# Altium schematic sheet ULA.SchDoc
size A3
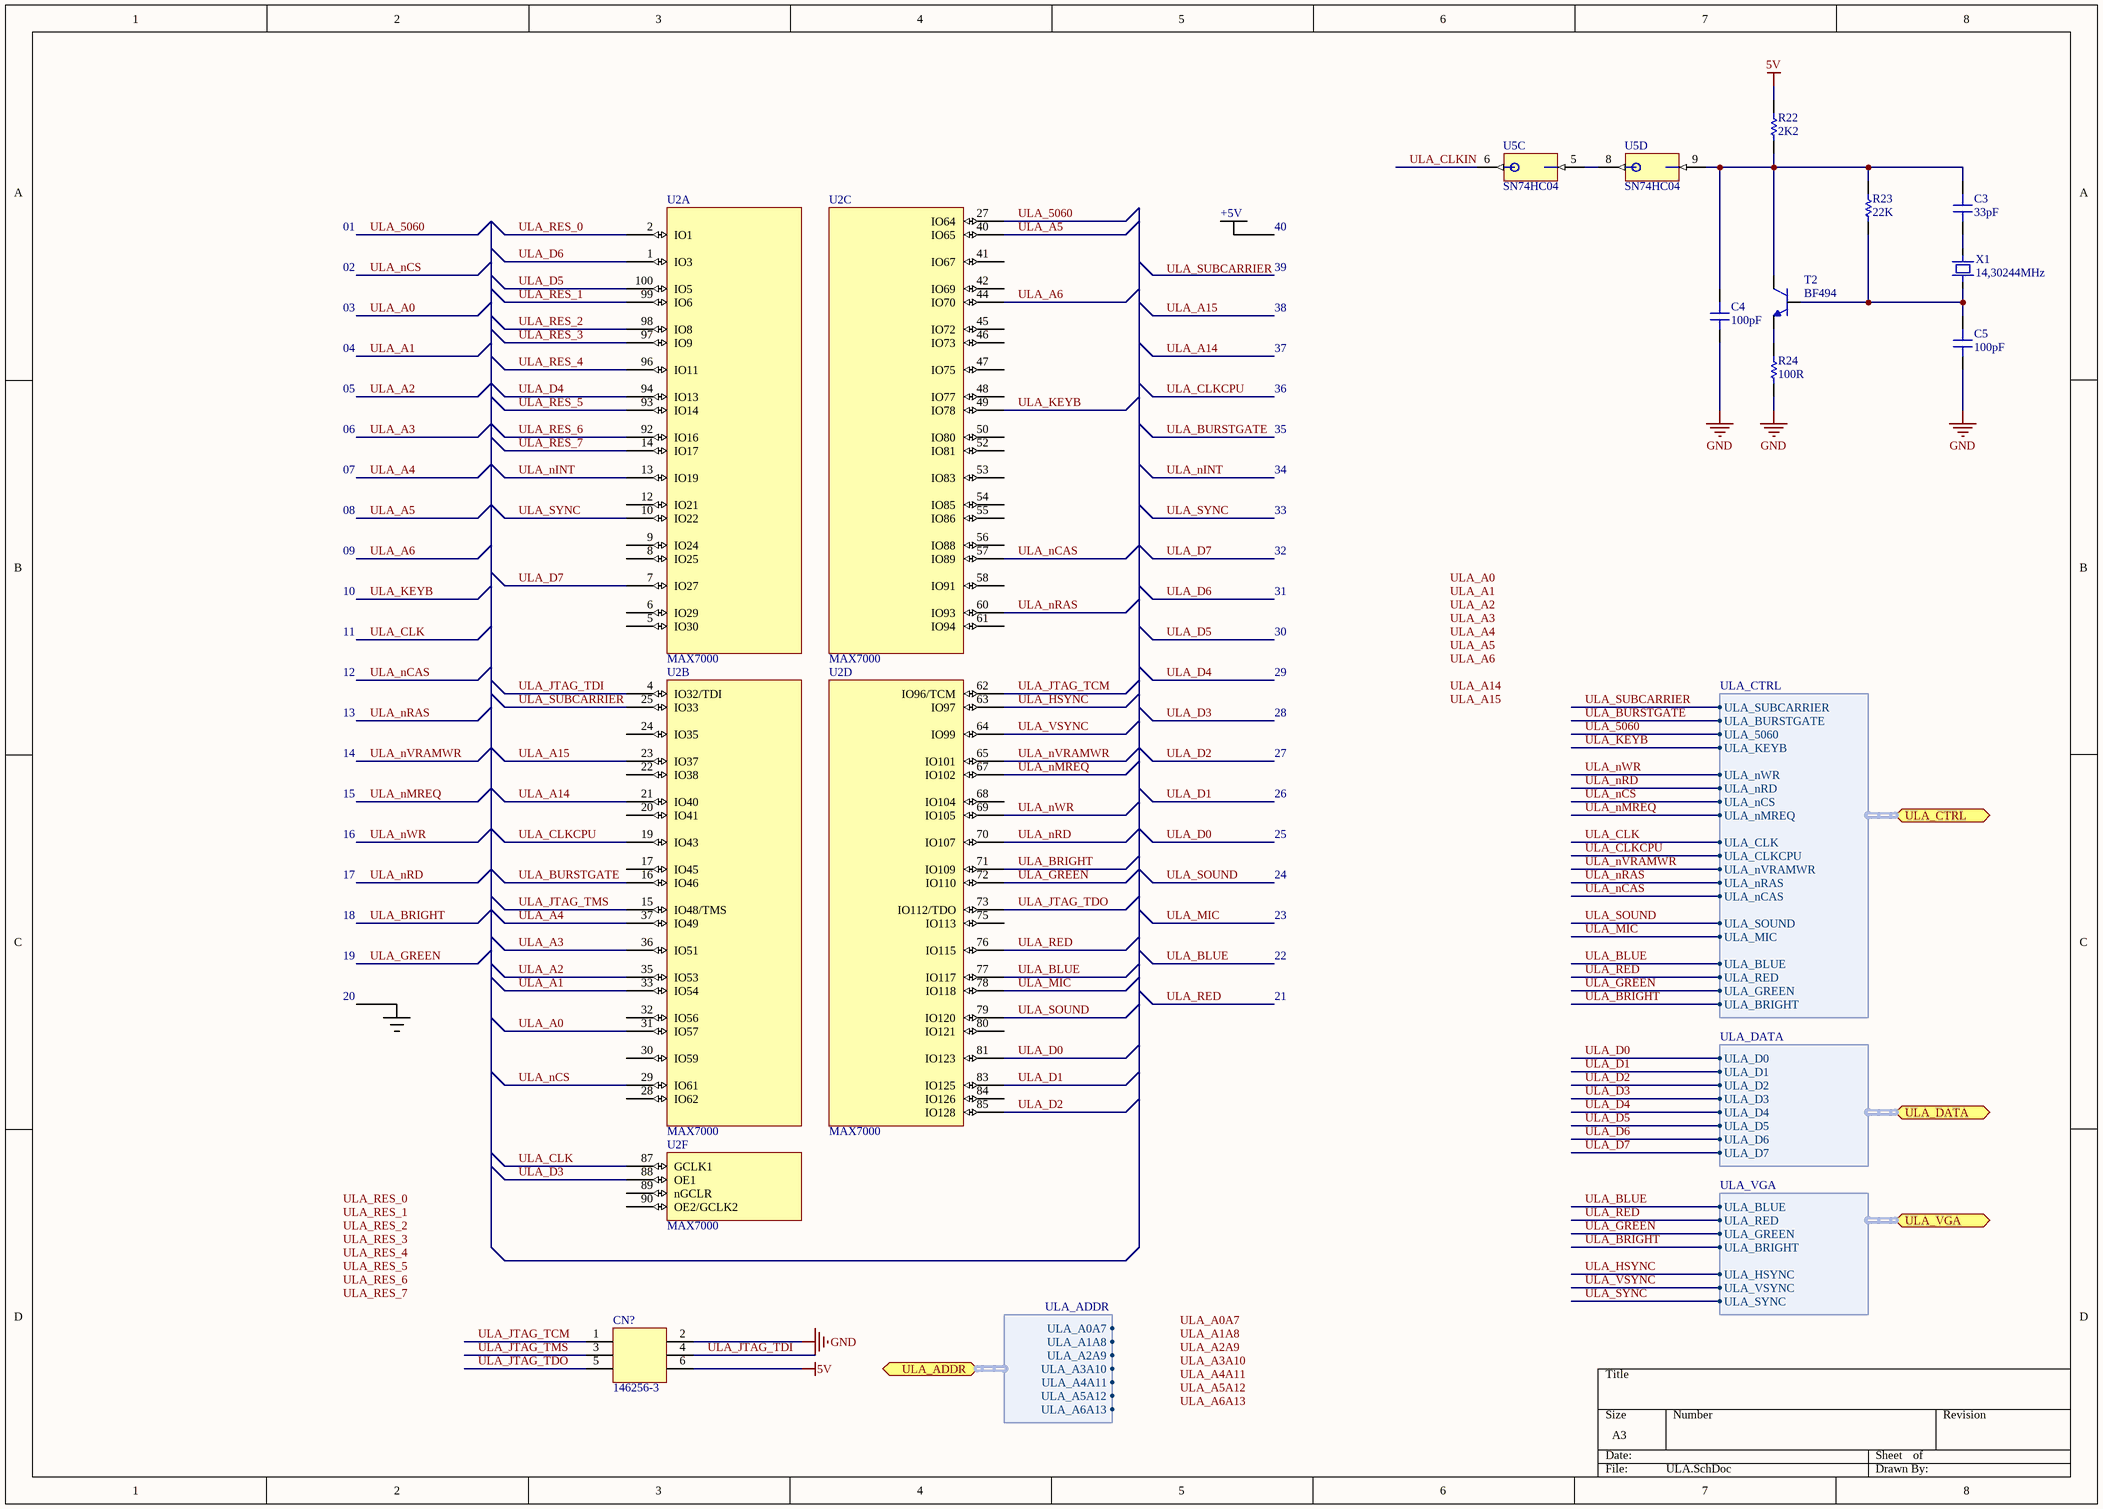
[diagram p0: ULA.SchDoc]

## Parts
C3  33pF  [0805]
C4  100pF  [0805]
C5  100pF  [0805]
CN?  146256-3  [146256-3]
R22  2K2  [0805]
R23  22K  [0805]
R24  100R  [0805]
T2  BF494  [TO-92]
U2  MAX7000  [TQFP100]  (parts A,B,C,D,F of 6)
U5  SN74HC04  [SOIC14]  (parts C,D of 7)
X1  14,30244MHz  [HC49S]

## Ports
ULA_ADDR (harness ULA_ADDR), ULA_CTRL (harness ULA_CTRL), ULA_DATA (harness ULA_DATA), ULA_VGA (harness ULA_VGA)

## Harnesses
ULA_CTRL: ULA_BURSTGATE, ULA_5060, ULA_KEYB, ULA_nWR, ULA_nRD, ULA_nCS, ULA_SUBCARRIER, ULA_nMREQ, ULA_CLK, ULA_CLKCPU, ULA_nVRAMWR, ULA_nRAS, ULA_nCAS, ULA_SOUND, ULA_MIC, ULA_BLUE, ULA_RED, ULA_GREEN, ULA_BRIGHT
ULA_ADDR: ULA_A0A7, ULA_A1A8, ULA_A2A9, ULA_A3A10, ULA_A4A11, ULA_A5A12, ULA_A6A13
ULA_DATA: ULA_D0, ULA_D1, ULA_D2, ULA_D3, ULA_D4, ULA_D5, ULA_D6, ULA_D7
ULA_VGA: ULA_BLUE, ULA_RED, ULA_GREEN, ULA_BRIGHT, ULA_HSYNC, ULA_VSYNC, ULA_SYNC

## Nets
5V: CN?.6 R22.2
GND: C4.1 C5.1 CN?.2 R24.1
ULA_5060: U2.27(IO64) ; port ULA_CTRL.ULA_5060
ULA_A0: U2.31(IO57)
ULA_A1: U2.33(IO54)
ULA_A2: U2.35(IO53)
ULA_A3: U2.36(IO51)
ULA_A4: U2.37(IO49)
ULA_A5: U2.40(IO65)
ULA_A6: U2.44(IO70)
ULA_A14: U2.21(IO40)
ULA_A15: U2.23(IO37)
ULA_BLUE: U2.77(IO117) ; port ULA_CTRL.ULA_BLUE, port ULA_VGA.ULA_BLUE
ULA_BRIGHT: U2.71(IO109) ; port ULA_CTRL.ULA_BRIGHT, port ULA_VGA.ULA_BRIGHT
ULA_BURSTGATE: U2.16(IO46) ; port ULA_CTRL.ULA_BURSTGATE
ULA_CLK: U2.87(GCLK1) ; port ULA_CTRL.ULA_CLK
ULA_CLKCPU: U2.19(IO43) ; port ULA_CTRL.ULA_CLKCPU
ULA_CLKIN: U5.6(Y)
ULA_D0: U2.81(IO123) ; port ULA_DATA.ULA_D0
ULA_D1: U2.83(IO125) ; port ULA_DATA.ULA_D1
ULA_D2: U2.85(IO128) ; port ULA_DATA.ULA_D2
ULA_D3: U2.88(OE1) ; port ULA_DATA.ULA_D3
ULA_D4: U2.94(IO13) ; port ULA_DATA.ULA_D4
ULA_D5: U2.100(IO5) ; port ULA_DATA.ULA_D5
ULA_D6: U2.1(IO3) ; port ULA_DATA.ULA_D6
ULA_D7: U2.7(IO27) ; port ULA_DATA.ULA_D7
ULA_GREEN: U2.72(IO110) ; port ULA_CTRL.ULA_GREEN, port ULA_VGA.ULA_GREEN
ULA_HSYNC: U2.63(IO97) ; port ULA_VGA.ULA_HSYNC
ULA_JTAG_TCM: CN?.1 U2.62(IO96/TCM)
ULA_JTAG_TDI: CN?.4 U2.4(IO32/TDI)
ULA_JTAG_TDO: CN?.5 U2.73(IO112/TDO)
ULA_JTAG_TMS: CN?.3 U2.15(IO48/TMS)
ULA_KEYB: U2.49(IO78) ; port ULA_CTRL.ULA_KEYB
ULA_MIC: U2.78(IO118) ; port ULA_CTRL.ULA_MIC
ULA_nCAS: U2.57(IO89) ; port ULA_CTRL.ULA_nCAS
ULA_nCS: U2.29(IO61) ; port ULA_CTRL.ULA_nCS
ULA_nINT: U2.13(IO19)
ULA_nMREQ: U2.67(IO102) ; port ULA_CTRL.ULA_nMREQ
ULA_nRAS: U2.60(IO93) ; port ULA_CTRL.ULA_nRAS
ULA_nRD: U2.70(IO107) ; port ULA_CTRL.ULA_nRD
ULA_nVRAMWR: U2.65(IO101) ; port ULA_CTRL.ULA_nVRAMWR
ULA_nWR: U2.69(IO105) ; port ULA_CTRL.ULA_nWR
ULA_RED: U2.76(IO115) ; port ULA_CTRL.ULA_RED, port ULA_VGA.ULA_RED
ULA_RES_0: U2.2(IO1)
ULA_RES_1: U2.99(IO6)
ULA_RES_2: U2.98(IO8)
ULA_RES_3: U2.97(IO9)
ULA_RES_4: U2.96(IO11)
ULA_RES_5: U2.93(IO14)
ULA_RES_6: U2.92(IO16)
ULA_RES_7: U2.14(IO17)
ULA_SOUND: U2.79(IO120) ; port ULA_CTRL.ULA_SOUND
ULA_SUBCARRIER: U2.25(IO33) ; port ULA_CTRL.ULA_SUBCARRIER
ULA_SYNC: U2.10(IO22) ; port ULA_VGA.ULA_SYNC
ULA_VSYNC: U2.64(IO99) ; port ULA_VGA.ULA_VSYNC
NetC3_1: C3.1 X1.2
NetC3_2: C3.2 C4.2 R22.1 R23.2 T2.3 U5.9(A)
NetC5_2: C5.2 R23.1 T2.1 X1.1
NetR24_2: R24.2 T2.2
NetU5_5: U5.5(A) U5.8(Y)

Not connected (* = marked no-connect by the designer): U2 5(IO30) 6(IO29) 8(IO25) 9(IO24) 12(IO21) 17(IO45) 20(IO41) 22(IO38) 24(IO35) 28(IO62) 30(IO59) 32(IO56) 41(IO67) 42(IO69) 45(IO72) 46(IO73) 47(IO75) 48(IO77) 50(IO80) 52(IO81) 53(IO83) 54(IO85) 55(IO86) 56(IO88) 58(IO91) 61(IO94) 68(IO104) 75(IO113) 80(IO121) 84(IO126) 89(nGCLR) 90(OE2/GCLK2)

## Notes on the sheet
- 01
- +5V
- 40
- 02
- 03
- 38
- 39
- 04
- 37
- 05
- 06
- 35
- 36
- 07
- 08
- 33
- 34
- 09
- 32
- 10
- 11
- 30
- 31
- 12
- 13
- 28
- 29
- 14
- 27
- 15
- 16
- 25
- 26
- 17
- 18
- 23
- 24
- 19
- 22
- 20
- 21
- Labels drawn without touching a wire or pin: ULA_A0, ULA_A0A7, ULA_A1, ULA_A1A8, ULA_A2, ULA_A2A9, ULA_A3, ULA_A3A10, ULA_A4, ULA_A4A11, ULA_A5, ULA_A5A12, ULA_A6, ULA_A6A13, ULA_A14, ULA_A15, ULA_RES_0, ULA_RES_1, ULA_RES_2, ULA_RES_3, ULA_RES_4, ULA_RES_5, ULA_RES_6, ULA_RES_7, ULA_SUBCARRIER

## Library data of the parts
C3-C5 = Capacitor
CN? = 146256-3: CONN Header Breakaway
R22-R24 = Resistor
T2 = BF494: NPN Medium Frequency Transistors
U5 = SN74HC04: Hex Inverters
X1 = HC49S: Crystal HC49S